# EAGLE design ONOFRE_WIRE_SHIELD (EAGLE 9.4.1)
CNAME: BH ONOFRE; CREVISION: 5.1; DESIGNER: BrunoHorta
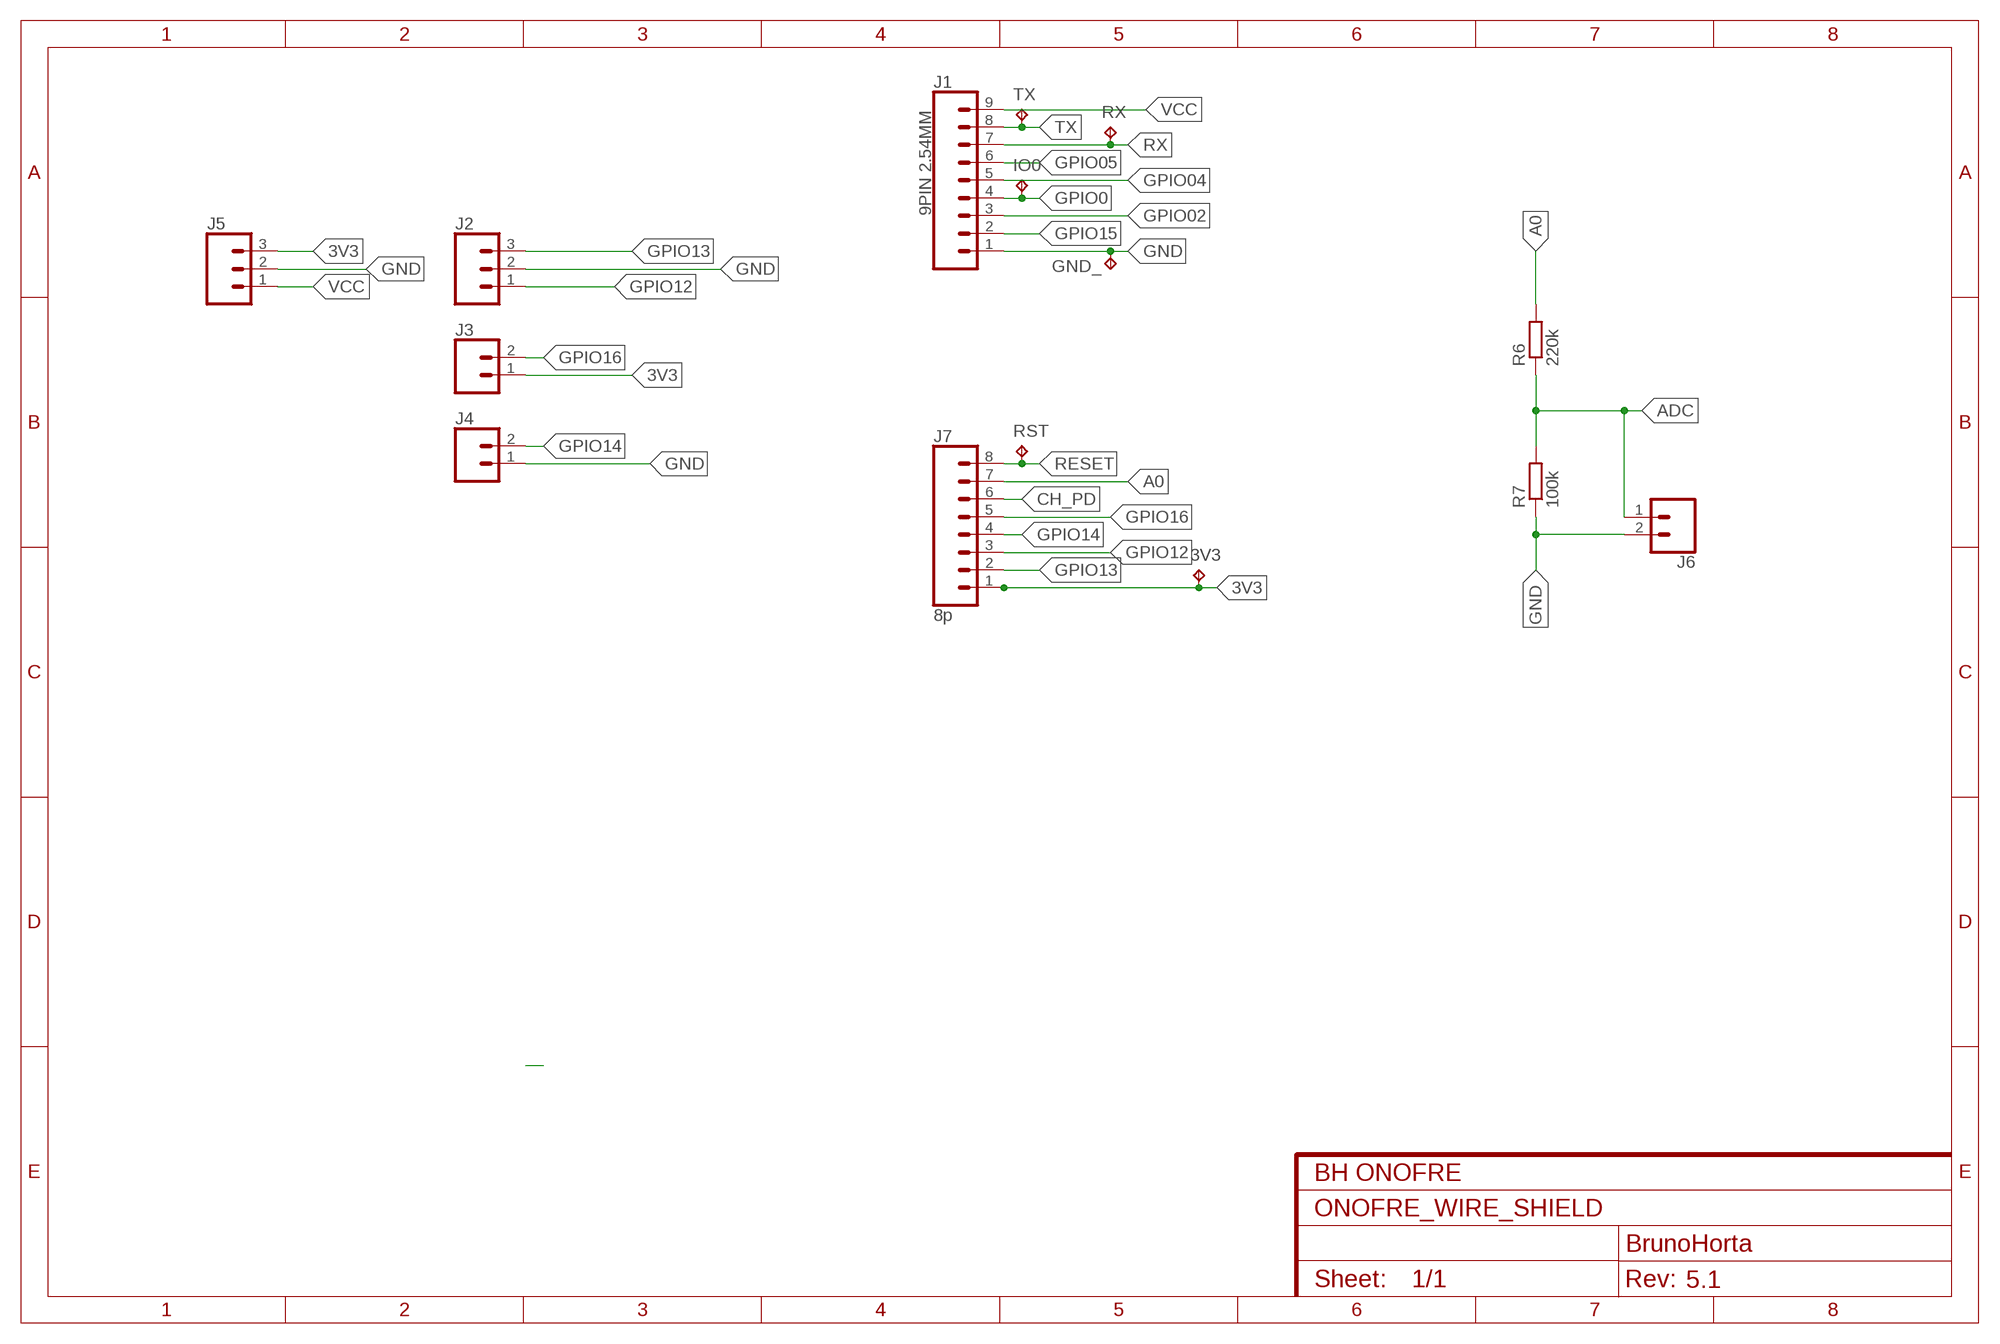
[diagram p0: schematic, sheet 1]

## Parts
3V3  TPB1,27  [B1,27]
GND_  TPB1,27  [B1,27]
IO0  TPB1,27  [B1,27]
J1  9PIN 2.54MM  CONN_09  [1X09]
J2  CONN_03  [1X03]
J3  CONN_02  [1X02]
J4  CONN_02  [1X02]
J5  CONN_03  [1X03]
J6  CONN_02  [1X02]
J7  8p  CONN_08"  [1X08]
R6  220k  R-EU_R0603  [R0603]
R7  100k  R-EU_R0603  [R0603]
RST  TPB1,27  [B1,27]
RX  TPB1,27  [B1,27]
TX  TPB1,27  [B1,27]

## Nets
3V3: 3V3.TP J3.1 J5.3 J7.1
A0: J7.7 R6.2
ADC: J6.1 R6.1 R7.2
CH_PD: J7.6
GND: GND_.TP J1.1 J2.2 J4.1 J5.2 J6.2 R7.1
GPIO0: IO0.TP J1.4
GPIO02: J1.3
GPIO04: J1.5
GPIO05: J1.6
GPIO12: J2.1 J7.3
GPIO13: J2.3 J7.2
GPIO14: J4.2 J7.4
GPIO15: J1.2
GPIO16: J3.2 J7.5
RESET: J7.8 RST.TP
RX: J1.7 RX.TP
TX: J1.8 TX.TP
VCC: J1.9 J5.1

## Library data of the parts
3V3 GND_ IO0 RST RX TX = testpad:TP: Test pad
J1 = SparkFun-Connectors:CONN_09: Multi connection point. Often used as Generic Header-pin footprint for 0.1 inch spaced/style header connections On any of the 0.1 inch spaced packages, you can populate with these: Break Away Headers - Straight <https://www.sparkfun.com/products/116> (PRT-00116) Break Away Male Headers - Right Angle <https://www.sparkfun.com/products/553> (PRT-00553) Female Headers <https://www.sparkfun.com/products/115> (PRT-00115) Break Away Headers - Machine Pin <https://www.sparkfun.com/products/117> (PRT-00117) Break Away Female Headers - Swiss Machine Pin <https://www.sparkfun.com/products/743> (PRT-00743) For SCREWTERMINALS and SPRING TERMINALS visit here: Screw Terimnals on SparkFun.com <https://www.sparkfun.com/search/results?term=Screw+Terminals> (5mm/3.5mm/2.54mm spacing) This device is also useful as a general connection point to wire up your design to another part of your project. Our various solder wires solder well into these plated through hole pads. Hook-Up Wire - Assortment (Stranded, 22 AWG) <https://www.sparkfun.com/products/11375> (PRT-11375) Hook-Up Wire - Assortment (Solid Core, 22 AWG) <https://www.sparkfun.com/products/11367> (PRT-11367) View the entire wire category on our website here <https://www.sparkfun.com/categories/141> Special notes: Molex polarized connector foot print use with SKU : PRT-08231 with associated crimp pins and housings. 1MM SMD Version SKU: PRT-10208 NOTES ON THE VARIANTS LOCK and LOCK_LONGPADS... This footprint was designed to help hold the alignment of a through-hole component (i.e. 6-pin header) while soldering it into place. You may notice that each hole has been shifted either up or down by 0.005 of an inch from it's more standard position (which is a perfectly straight line). This slight alteration caused the pins (the squares in the middle) to touch the edges of the holes. Because they are alternating, it causes a "brace" to hold the component in place. 0.005 has proven to be the perfect amount of "off-center" position when using our standard breakaway headers. Although looks a little odd when you look at the bare footprint, once you have a header in there, the alteration is very hard to notice. Also,if you push a header all the way into place, it is covered up entirely on the bottom side.
J2 J5 = SparkFun-Connectors:CONN_03: Multi connection point. Often used as Generic Header-pin footprint for 0.1 inch spaced/style header connections On any of the 0.1 inch spaced packages, you can populate with these: Break Away Headers - Straight <https://www.sparkfun.com/products/116> (PRT-00116) Break Away Male Headers - Right Angle <https://www.sparkfun.com/products/553> (PRT-00553) Female Headers <https://www.sparkfun.com/products/115> (PRT-00115) Break Away Headers - Machine Pin <https://www.sparkfun.com/products/117> (PRT-00117) Break Away Female Headers - Swiss Machine Pin <https://www.sparkfun.com/products/743> (PRT-00743) Stackable Header - 3 Pin (Female, 0.1") <https://www.sparkfun.com/products/13875> (PRT-13875) For SCREWTERMINALS and SPRING TERMINALS visit here: Screw Terimnals on SparkFun.com <https://www.sparkfun.com/search/results?term=Screw+Terminals> (5mm/3.5mm/2.54mm spacing) This device is also useful as a general connection point to wire up your design to another part of your project. Our various solder wires solder well into these plated through hole pads. Hook-Up Wire - Assortment (Stranded, 22 AWG) <https://www.sparkfun.com/products/11375> (PRT-11375) Hook-Up Wire - Assortment (Solid Core, 22 AWG) <https://www.sparkfun.com/products/11367> (PRT-11367) View the entire wire category on our website here <https://www.sparkfun.com/categories/141> Special notes: Molex polarized connector foot print use with SKU : PRT-08232 with associated crimp pins and housings.
J3 J4 J6 = SparkFun-Connectors:CONN_02: Multi connection point. Often used as Generic Header-pin footprint for 0.1 inch spaced/style header connections On any of the 0.1 inch spaced packages, you can populate with these: Break Away Headers - Straight <https://www.sparkfun.com/products/116> (PRT-00116) Break Away Male Headers - Right Angle <https://www.sparkfun.com/products/553> (PRT-00553) Female Headers <https://www.sparkfun.com/products/115> (PRT-00115) Break Away Headers - Machine Pin <https://www.sparkfun.com/products/117> (PRT-00117) Break Away Female Headers - Swiss Machine Pin <https://www.sparkfun.com/products/743> (PRT-00743) For SCREWTERMINALS and SPRING TERMINALS visit here: Screw Terimnals on SparkFun.com <https://www.sparkfun.com/search/results?term=Screw+Terminals> (5mm/3.5mm/2.54mm spacing) This device is also useful as a general connection point to wire up your design to another part of your project. Our various solder wires solder well into these plated through hole pads. Hook-Up Wire - Assortment (Stranded, 22 AWG) <https://www.sparkfun.com/products/11375> (PRT-11375) Hook-Up Wire - Assortment (Solid Core, 22 AWG) <https://www.sparkfun.com/products/11367> (PRT-11367) View the entire wire category on our website here <https://www.sparkfun.com/categories/141> Special notes: Molex polarized connector foot print use with: PRT-08233 with associated crimp pins and housings. 2.54_SCREWTERM for use with PRT-10571. 3.5mm Screw Terminal footprints for PRT-08084 5mm Screw Terminal footprints for use with PRT-08432
J7 = SparkFun-Connectors:CONN_08: Multi connection point. Often used as Generic Header-pin footprint for 0.1 inch spaced/style header connections On any of the 0.1 inch spaced packages, you can populate with these: Break Away Headers - Straight <https://www.sparkfun.com/products/116> (PRT-00116) Break Away Male Headers - Right Angle <https://www.sparkfun.com/products/553> (PRT-00553) Female Headers <https://www.sparkfun.com/products/115> (PRT-00115) Break Away Headers - Machine Pin <https://www.sparkfun.com/products/117> (PRT-00117) Break Away Female Headers - Swiss Machine Pin <https://www.sparkfun.com/products/743> (PRT-00743) Arduino Stackable Header - 8 Pin <https://www.sparkfun.com/products/9279> (PRT-09279) For SCREWTERMINALS and SPRING TERMINALS visit here: Screw Terimnals on SparkFun.com <https://www.sparkfun.com/search/results?term=Screw+Terminals> (5mm/3.5mm/2.54mm spacing) This device is also useful as a general connection point to wire up your design to another part of your project. Our various solder wires solder well into these plated through hole pads. Hook-Up Wire - Assortment (Stranded, 22 AWG) <https://www.sparkfun.com/products/11375> (PRT-11375) Hook-Up Wire - Assortment (Solid Core, 22 AWG) <https://www.sparkfun.com/products/11367> (PRT-11367) View the entire wire category on our website here <https://www.sparkfun.com/categories/141> Special notes: Molex polarized connector foot print use with SKU : PRT-08231 with associated crimp pins and housings. 1MM SMD Version SKU: PRT-10208 NOTES ON THE VARIANTS LOCK and LOCK_LONGPADS... This footprint was designed to help hold the alignment of a through-hole component (i.e. 6-pin header) while soldering it into place. You may notice that each hole has been shifted either up or down by 0.005 of an inch from it's more standard position (which is a perfectly straight line). This slight alteration caused the pins (the squares in the middle) to touch the edges of the holes. Because they are alternating, it causes a "brace" to hold the component in place. 0.005 has proven to be the perfect amount of "off-center" position when using our standard breakaway headers. Although looks a little odd when you look at the bare footprint, once you have a header in there, the alteration is very hard to notice. Also,if you push a header all the way into place, it is covered up entirely on the bottom side.; PROD_ID: CONN-08438
R6 R7 = resistor:R-EU_: RESISTOR, European symbol

## Net classes
1 220V: width 1.27 mm, clearance 2 mm

## Board
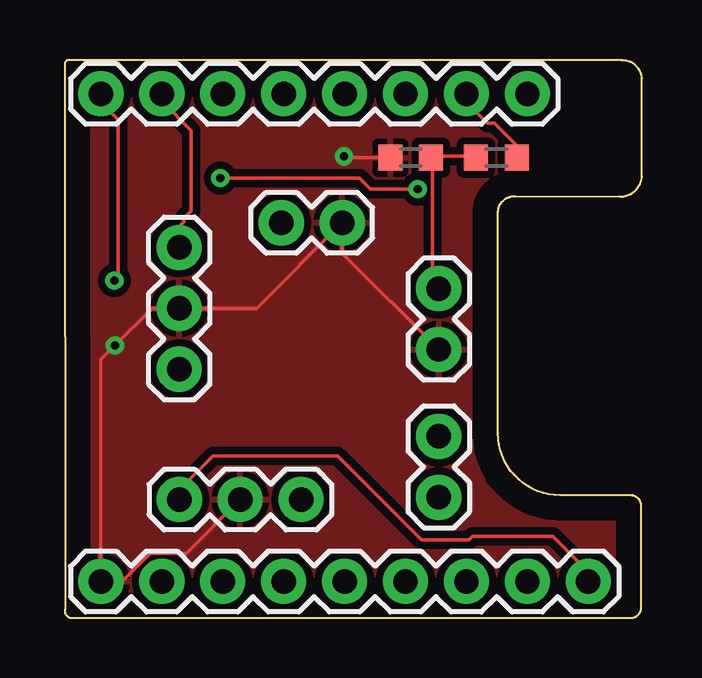
[diagram p1: board, top side]
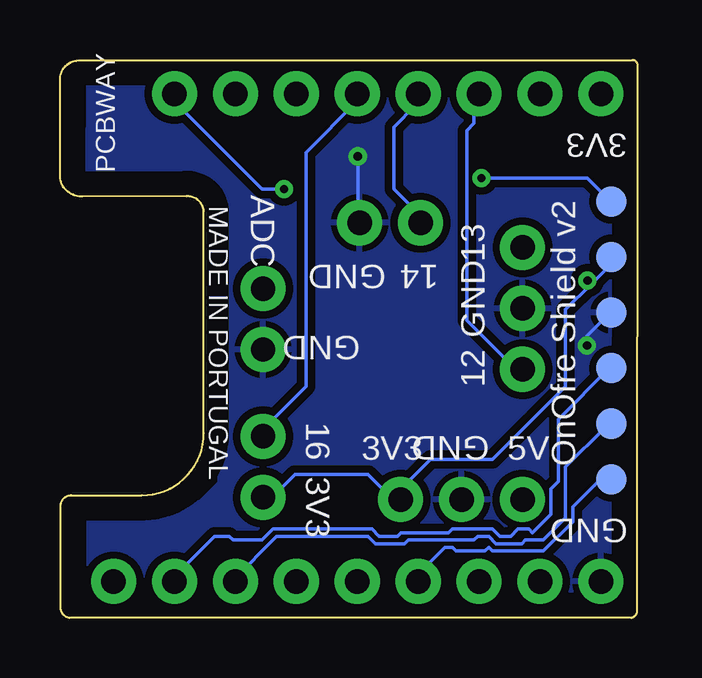
[diagram p2: board, bottom side, seen from below]

Size 24.06 x 23.27 mm. Coordinates in mm from the lower left corner, seen from the top.
Outline: 0,23.11 0.01,0.35 arc90 0.25,0 23.66,0 arc90 24.03,0.52 24.03,4.7 arc90 23.58,5.11 20.66,5.11 arc-90 18.07,7.7 18.07,16.96 arc-90 18.8,17.58 23.12,17.57 arc90 24.06,18.41 24.06,22.5 arc90 23.21,23.25 0.22,23.26 arc90 0,23.11
Copper layers (1*16): Top 0.035mm / dielectric 1.5mm / Bottom 0.035mm
Design rules "default": minimum track width 6mil, minimum drill 0.35mm, track to track 6mil, track to pad 6mil, pad to pad 6mil, via to via 6mil, smd to smd 6mil, copper to edge 40mil, drill to drill 6mil, minimum pad ring 10mil, minimum via ring 8mil, stop-mask expansion 4mil, vias tented up to drill 0mil, thermal gap 10mil

### Footprints (pad centres in the part's own frame; a part is rotated, then mirrored left to right if it is on the bottom)
B1,27 = smd 1.27 x 1.27: TP 0,0
1X09 = drill 1.016 pad 1.88: 1 0,0; 2 2.54,0; 3 5.08,0; 4 7.62,0; 5 10.16,0; 6 12.7,0; 7 15.24,0; 8 17.78,0; 9 20.32,0
1X03 = drill 1.016 pad 1.88: 1 0,0; 2 2.54,0; 3 5.08,0
1X02 = drill 1.016 pad 1.88: 1 0,0; 2 2.54,0
1X08 = drill 1.016 pad 1.88: 1 0,0; 2 2.54,0; 3 5.08,0; 4 7.62,0; 5 10.16,0; 6 12.7,0; 7 15.24,0; 8 17.78,0
R0603 = smd 1 x 1.1: 1 -0.85,0; 2 0.85,0

### Placement (x,y rotation side)
3V3  1.07,15.05 0 bottom
GND_  1.07,12.74 0 bottom
IO0  1.07,5.78 0 bottom
J1  1.51,1.52 0 top
J2  4.78,10.37 90 top
J3  15.59,5.03 90 top
J4  11.57,16.48 180 top
J5  4.78,4.94 0 top
J6  15.59,13.73 270 top
J7  1.51,21.86 0 top
R6  18,19.2 0 top
R7  14.42,19.2 0 top
RST  1.07,17.37 0 bottom
RX  1.07,8.1 0 bottom
TX  1.07,10.42 0 bottom

### Tracks (layer width: path | path; a pad name or v marks a point on that pad's centre or on a via)
3V3  (via drill 0.35)
  Top 0.152: v2.07,14.07 2.22,14.22 2.22,20.78 1.61,21.39 1.61,21.84 J7.1
  Bottom 0.152: 1.92,13.92 2.99,12.85 2.99,9.65 6.03,6.6 8.62,6.6 9.84,5.38 9.84,5.08 J5.3 10,5.08 10.3,5.08 11.22,5.99 14.26,5.99 15.18,5.08 15.48,5.08 J3.1 | 1.92,13.92 1.16,14.68 1.16,14.99 3V3.TP | 1.92,13.92 v2.07,14.07
A0
  Top 0.152: R6.2 18.84,19.25 18.84,19.71 17.92,20.62 17.62,20.62 16.85,21.39 16.85,21.84 J7.7
ADC
  Top 0.152: R6.1 17.01,19.25 15.33,19.25 R7.2 15.33,19.1 15.33,13.92 15.48,13.77 J6.1
GND  (via drill 0.35)
  Top 0.152: J6.2 11.57,15.22 J4.1 8,12.91 J2.2 3.64,12.91 v2.09,11.36 1.51,10.78 J1.1 2.4,1.52 3.57,2.69 5.07,2.69 J5.2 | R7.1 11.7,19.2 v11.65,19.25
  Bottom 0.152: GND_.TP 1.16,12.7 2.09,11.76 v2.09,11.36 | v11.65,19.25 11.65,16.55 J4.1
  pour Bottom (isolate 0.305): 0.07,23.08 0.07,0.54 0.46,0.16 23.32,0.16 23.59,0.43 23.59,4.24 23.62,4.26 23,4.88 23,4.88 18.25,4.88 17.45,5.68 17.45,17.02 17.63,17.2 18.51,18.09 18.69,18.09 23,18.09 23.09,18.18 23.09,22.84 23.12,22.87 22.88,23.11 22.85,23.11 0.19,23.11 0.1,23.02
  pour Top (isolate 0.305): 0.11,22.94 0.11,0.53 0.55,0.09 23.38,0.09 23.44,0.15 23.64,0.35 23.64,4.22 22.97,4.88 22.91,4.88 18.34,4.88 18.32,4.86 18.3,4.86 17.51,5.65 17.51,17.07 18.54,18.1 22.83,18.1 22.87,18.06 22.97,18.06 23.12,18.21 23.12,22.88 23.06,22.94 22.87,23.12 22.83,23.12 0.31,23.12 0.15,22.96
GPIO0
  Bottom 0.152: IO0.TP 1.16,5.69 1.61,5.69 2.68,4.62 2.68,4.01 3.9,2.79 6.03,2.79 6.19,2.95 6.34,2.79 7.56,2.79 7.71,2.95 8.01,2.95 9.08,1.88 9.08,1.57 J1.4
GPIO12
  Bottom 0.152: J2.1 4.81,10.41 5.12,10.41 7.1,12.39 7.1,20.32 6.8,20.62 6.8,21.69 6.64,21.84 J7.3
GPIO13
  Top 0.152: J7.2 4.05,21.84 4.05,21.54 5.27,20.32 5.27,16.97 4.97,16.66 4.97,16.51 4.81,16.36 4.81,15.6 J2.3
GPIO14
  Bottom 0.152: J4.2 9.08,16.51 9.08,16.82 10.15,17.88 10.15,20.47 9.23,21.39 9.23,21.84 J7.4
GPIO16
  Bottom 0.152: J7.5 11.67,21.84 11.67,21.54 13.81,19.41 13.81,9.65 15.48,7.98 15.48,7.67 J3.2
RESET  (via drill 0.35)
  Top 0.152: v6.49,18.34 12.28,18.34 12.74,17.88 v14.72,17.88
  Bottom 0.152: v6.49,18.34 2.07,18.34 1.16,17.42 RST.TP | v14.72,17.88 15.63,17.88 19.14,21.39 19.14,21.84 J7.8
RX
  Bottom 0.152: RX.TP 1.16,7.98 1.31,7.98 2.99,6.3 2.99,4.17 3.9,3.25 4.66,3.25 4.81,3.1 5.88,3.1 6.19,3.4 6.64,3.4 6.8,3.25 9.54,3.25 9.69,3.1 10.91,3.1 11.22,3.4 15.03,3.4 16.85,1.57 J1.7
TX
  Bottom 0.152: TX.TP 1.16,10.41 3.29,8.28 3.29,5.69 3.6,5.38 3.6,4.32 4.36,3.56 4.51,3.71 4.97,3.71 5.27,3.4 5.73,3.4 6.03,3.71 7.71,3.71 7.86,3.56 9.84,3.56 10,3.4 10.76,3.4 11.06,3.71 15.18,3.71 15.63,3.25 16.85,3.25 17.01,3.4 17.62,3.4 19.14,1.88 19.14,1.57 J1.8
VCC
  Top 0.152: J5.1 4.81,5.08 4.81,5.38 6.19,6.76 11.37,6.76 14.87,3.25 16.85,3.25 17.01,3.4 20.36,3.4 21.73,2.03 21.73,1.57 J1.9

### Text on the board
bNames: 3V3 | PCBWAY | ADC | MADE IN PORTUGAL | 13 | 14 | GND | GND | GND | 12 | GND | 16 | 5V | 3V3 | OnOfre Shield v2 | 3V3 | GND